# Altium schematic sheet Sheet1.tamrin1.SchDoc
size A4
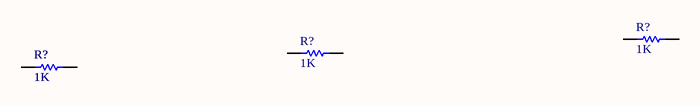
[diagram p0: Sheet1.tamrin1.SchDoc]

## Parts
(Parts that share a designator on the sheet are numbered #1, #2 ... from top to bottom, then left to right.)
R?#1  value 1K  (hidden comment: Resistor)
R?#2  value 1K  (hidden comment: Resistor)
R?#3  value 1K  (hidden comment: Resistor)
R?#4  value 1K  (hidden comment: Resistor)

## Nets
NetR?#3_1: R?#3.1 R?#4.1
NetR?#3_2: R?#3.2 R?#4.2

Not connected (* = marked no-connect by the designer): R?#1 1 2; R?#2 1 2

## Library data of the parts
R?#1-R?#4 = Resistor: TC1: 0; SimulationGenericComponent: True; TC2: 0